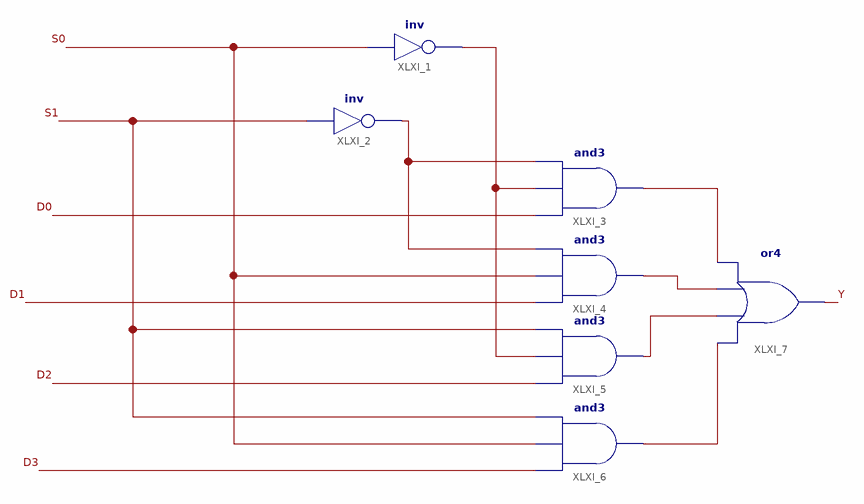
[diagram p0: schematic sheet 1]
// Xilinx ISE schematic multiplexer.sch (artix7) as structural Verilog: 7 symbols, 0 ports
module multiplexer (
);

  wire D0, D1, D2, D3, S0, S1, XLXN_13, XLXN_14, XLXN_25, XLXN_26, XLXN_28, XLXN_29, Y;

  not XLXI_1 (XLXN_13, S0);
  not XLXI_2 (XLXN_14, S1);
  and XLXI_3 (XLXN_25, D0, XLXN_13, XLXN_14);
  and XLXI_4 (XLXN_26, D1, S0, XLXN_14);
  and XLXI_5 (XLXN_28, D2, XLXN_13, S1);
  and XLXI_6 (XLXN_29, D3, S0, S1);
  or XLXI_7 (Y, XLXN_29, XLXN_28, XLXN_26, XLXN_25);
endmodule
